# Altium project ST1-2.PrjPcb
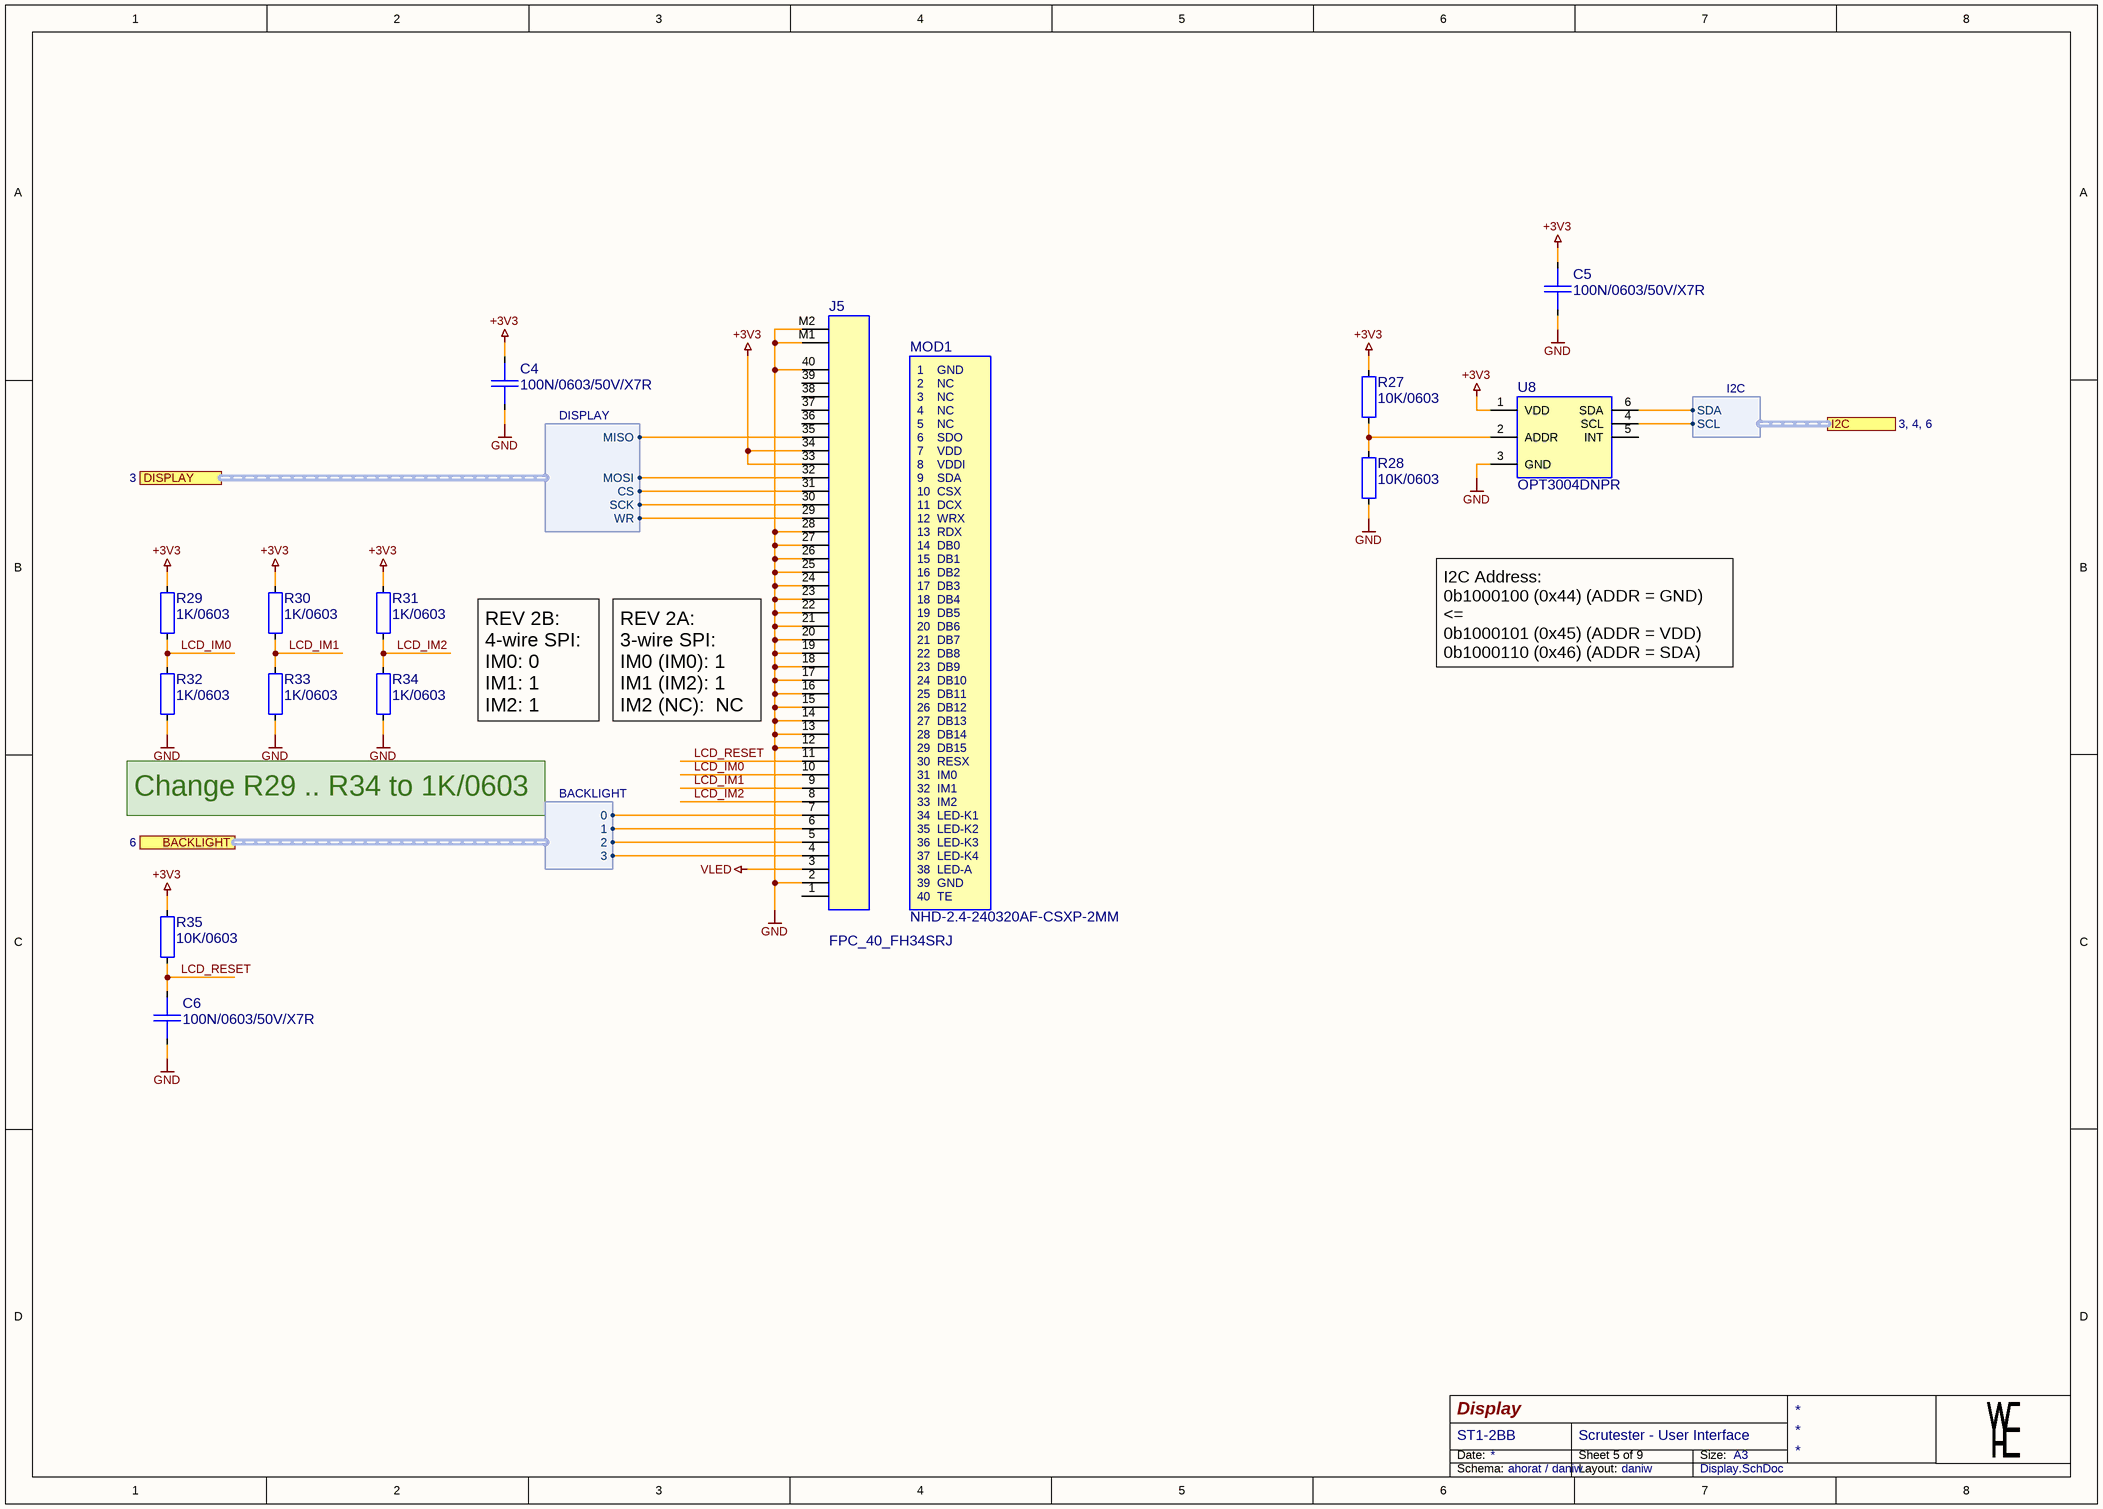
[diagram p0: Display.SchDoc]
Author: ahorat / daniw; Index_Main: B; Index_Sub: B; Layout_Designer: daniw; PCB_NAME: ST1-2; Project: Scrutester - User Interface; Project_URL: https://github.com/daniw/scrutester; Schema_Designer: ahorat / daniw
1 sheet, 15 parts. Net scope: flat (ports and power ports of the same name join across sheets).
Board files: ST1-2-BASIS.PcbDoc, ST1-2-PANEL.PcbDoc

## Sheet Display.SchDoc: Display
size A3; SheetNumber: 5; SheetTotal: 9

### Parts
C4  100N/0603/50V/X7R  [CAP0603_X7R]
C5  100N/0603/50V/X7R  [CAP0603_X7R]
C6  100N/0603/50V/X7R  [CAP0603_X7R]
J5  FPC_40_FH34SRJ  [CON_FPC40_FH34SRJ]
MOD1  NHD-2.4-240320AF-CSXP-2MM  [NHD-2.4-240320AF-CSXP-2MM]
R27  10K/0603  [R0603-0.40-WW]
R28  10K/0603  [R0603-0.40-WW]
R29  1K/0603  [R0603-0.40-WW]
R30  1K/0603  [R0603-0.40-WW]
R31  1K/0603  [R0603-0.40-WW]
R32  1K/0603  [R0603-0.40-WW]
R33  1K/0603  [R0603-0.40-WW]
R34  1K/0603  [R0603-0.40-WW]
R35  10K/0603  [R0603-0.40-WW]
U8  OPT3004DNPR  [SON065P200X200X65-6-EP065X130-CLEAR]

### Ports
BACKLIGHT (harness BACKLIGHT, see 6), DISPLAY (harness DISPLAY, see 3), I2C (harness I2C, see 3, 4, 6)

### Harnesses
I2C: SCL, SDA
DISPLAY: MISO, MOSI, CS, SCK, WR
BACKLIGHT: 1, 2, 3, 0

### Nets
+3V3: C4.1 C5.1 J5.33 J5.34 R27.1 R29.1 R30.1 R31.1 R35.1 U8.1(VDD)
GND: C4.2 C5.2 C6.2 J5.2 J5.12 J5.13 J5.14 J5.15 J5.16 J5.17 J5.18 J5.19 J5.20 J5.21 J5.22 J5.23 J5.24 J5.25 J5.26 J5.27 J5.28 J5.40 J5.M1 J5.M2 R28.2 R32.2 R33.2 R34.2 U8.3(GND)
VLED: J5.3
LCD_IM0: J5.10 R29.2 R32.1
LCD_IM1: J5.9 R30.2 R33.1
LCD_IM2: J5.8 R31.2 R34.1
LCD_RESET: C6.1 J5.11 R35.2
NetJ5_4: J5.4 ; port BACKLIGHT.3
NetJ5_5: J5.5 ; port BACKLIGHT.2
NetJ5_6: J5.6 ; port BACKLIGHT.1
NetJ5_7: J5.7 ; port BACKLIGHT.0
NetJ5_29: J5.29 ; port DISPLAY.WR
NetJ5_30: J5.30 ; port DISPLAY.SCK
NetJ5_31: J5.31 ; port DISPLAY.CS
NetJ5_32: J5.32 ; port DISPLAY.MOSI
NetJ5_35: J5.35 ; port DISPLAY.MISO
NetR27_2: R27.2 R28.1 U8.2(ADDR)
NetU8_4: U8.4(SCL) ; port I2C.SCL
NetU8_6: U8.6(SDA) ; port I2C.SDA

Not connected (* = marked no-connect by the designer): J5 1 36 37 38 39; U8 5(INT)

### Notes on the sheet
- REV 2B:
  4-wire SPI:
  IM0: 0
  IM1: 1
  IM2: 1
- REV 2A:
  3-wire SPI:
  IM0 (IM0): 1
  IM1 (IM2): 1
  IM2 (NC):  NC
- I2C Address:
  0b1000100 (0x44) (ADDR = GND) <=
  0b1000101 (0x45) (ADDR = VDD)
  0b1000110 (0x46) (ADDR = SDA)
  0b1000111 (0x47) (ADDR = SCL)
- Change R29 .. R34 to 1K/0603
- Date:
- Size:
- A3
- Schema:
- Layout:
- (in symbol NHD-2.4-240320AF-CSXP-2MM) 1; GND; 2; NC; 3; 4; 5; 6; SDO; 7; VDD; 8; VDDI; 9; SDA; 10; CSX; 11; DCX; 12; WRX; 13; RDX; 14; DB0; 15; DB1; 16; DB2; 17; DB3; 18; DB4; 19; DB5; 20; DB6; 21; DB7; 22; DB8; 23; DB9; 24; DB10; 25; DB11; 26; DB12; 27; DB13; 28; DB14; 29; DB15; 30; RESX; 31; IM0; 32; IM1; 33; IM2; 34; LED-K1; 35; LED-K2; 36; LED-K3; 37; LED-K4; 38; LED-A; 39; 40; TE

### Library data of the parts
C4-C6 = 100N/0603/50V/X7R: CAP SM 0603 100nF 50V X7R; Manufacturer: GENERIC; Manufacturer 1: YAGEO; Manufacturer Part Number 1: CC0603KPX7R9BB104; Absolute Value: 1E-7; Eurocircuits GPN: GPC0603104; Part Number: 100N/0603/50V/X7R; Package: 0603; Value: 100nF; HelpURL: https://www.yageo.com/upload/media/product/app/datasheet/mlcc/upy-gphc_x7r_6_3v-to-250v.pdf; Supplier 1: Digi-Key; Supplier Part Number 1: 311-3567-1-ND; Supplier 3: LCSC; Supplier Part Number 3: C14663; Manufacturer 2: YAGEO; Manufacturer Part Number 2: CC0603MRX7R9BB104; Supplier 2: Digi-Key; Supplier Part Number 2: 311-4110-1-ND; JLC Type: Basic; Manufacturer Part Number 3: CC0603KRX7R9BB104
J5 = FPC_40_FH34SRJ: FPC connector, FH34 series, 40 pins; Manufacturer: Hirose; Manufacturer 1: Hirose Electric Co Ltd; Manufacturer Part Number 1: FH34SRJ-40S-0.5SH(50); Part Number: FPC_40_FH34SRJ; System: Connector; HelpURL: https://www.hirose.com/en/product/document?clcode=CL0580-1260-6-50&productname=FH34SRJ-40S-0.5SH(50)&series=FH34SRJ&documenttype=2DDrawing&lang=en&documentid=0001483059; Supplier 1: Digi-Key; Supplier Part Number 1: H125755CT-ND; Manufacturer 3: HRS; Manufacturer Part Number 3: FH34SRJ-40S-0.5SH(50); Supplier 3: LCSC; Supplier Part Number 3: C506798; JLC Type: Extended
MOD1 = NHD-2.4-240320AF-CSXP-2MM: NHD-2.4-240320AF-CSXP TFT Liquid Crystal Display, 2.4", 240x320, RGB, high brightness, 2mm above PCB; Manufacturer: Newhaven Display; Manufacturer 1: Newhaven Display Intl; Part Number: NHD-2.4-240320AF-CSXP-2MM; Package: Display Module; HelpURL: https://newhavendisplay.com/content/specs/NHD-2.4-240320AF-CSXP.pdf; Manufacturer Part Number 1: NHD-2.4-240320AF-CSXP; Supplier 1: Digi-Key; Supplier Part Number 1: 757-NHD-2.4-240320AF-CSXP-ND
R27 R28 R35 = 10K/0603: RES SM 0603 10K; Manufacturer: GENERIC; Manufacturer 1: YAGEO; Manufacturer Part Number 1: RC0603FR-1310KL; Absolute Value: 10000; Eurocircuits GPN: GPR060310K; Part Number: 10K/0603; Package: 0603; Value: 10K; HelpURL: https://www.yageogroup.com/content/datasheet/asset/file/PYU-RC_GROUP_51_ROHS_L; Supplier 1: Digi-Key; Supplier Part Number 1: 13-RC0603FR-1310KLCT-ND; Manufacturer 2: YAGEO; Manufacturer Part Number 2: RC0603FR-1010KL; Supplier 2: Digi-Key; Supplier Part Number 2: 13-RC0603FR-1010KLCT-ND; Manufacturer 3: UNI-ROYAL(Uniroyal Elec); Manufacturer Part Number 3: 0603WAF1002T5E; Supplier 3: LCSC; Supplier Part Number 3: C25804; JLC Type: Basic
R29-R34 = 1K/0603: RES SM 0603 1K; Manufacturer: GENERIC; Manufacturer 1: YAGEO; Manufacturer Part Number 1: RC0603FR-131KL; Absolute Value: 1000; Eurocircuits GPN: GPR06031K; Part Number: 1K/0603; Package: 0603; Value: 1K; HelpURL: https://www.yageogroup.com/content/datasheet/asset/file/PYU-RC_GROUP_51_ROHS_L; Supplier 1: Digi-Key; Supplier Part Number 1: 13-RC0603FR-131KLCT-ND; Manufacturer 2: YAGEO; Manufacturer Part Number 2: RC0603FR-101KL; Supplier 2: Digi-Key; Supplier Part Number 2: 13-RC0603FR-101KLCT-ND; Manufacturer 3: UNI-ROYAL(Uniroyal Elec); Manufacturer Part Number 3: 0603WAF1001T5E; Supplier 3: LCSC; Supplier Part Number 3: C21190; JLC Type: Basic
U8 = OPT3004DNPR: OPT3004DNPR, OPT3004 Ambient Light Sensor (ALS) With Excellent Angular IR Rejection, USON8; Manufacturer: Texas Instruments; Part Number: OPT3004DNPR; Package: USON-8; HelpURL: https://www.ti.com/lit/ds/symlink/opt3004.pdf; Manufacturer 1: Texas Instruments; Manufacturer Part Number 1: OPT3004DNPR; Supplier 1: Digi-Key; Supplier Part Number 1: 296-53402-6-ND; Manufacturer 3: TI; Manufacturer Part Number 3: OPT3004DNPR; Supplier 3: LCSC; Supplier Part Number 3: C2655153; JLC Type: Extended

## Assembly variants
ST1-2: not fitted J1 J2 J3 L4 Q8 R27 R29 R33 R34